# EAGLE design D1MSERVO (EAGLE 6.5.0)
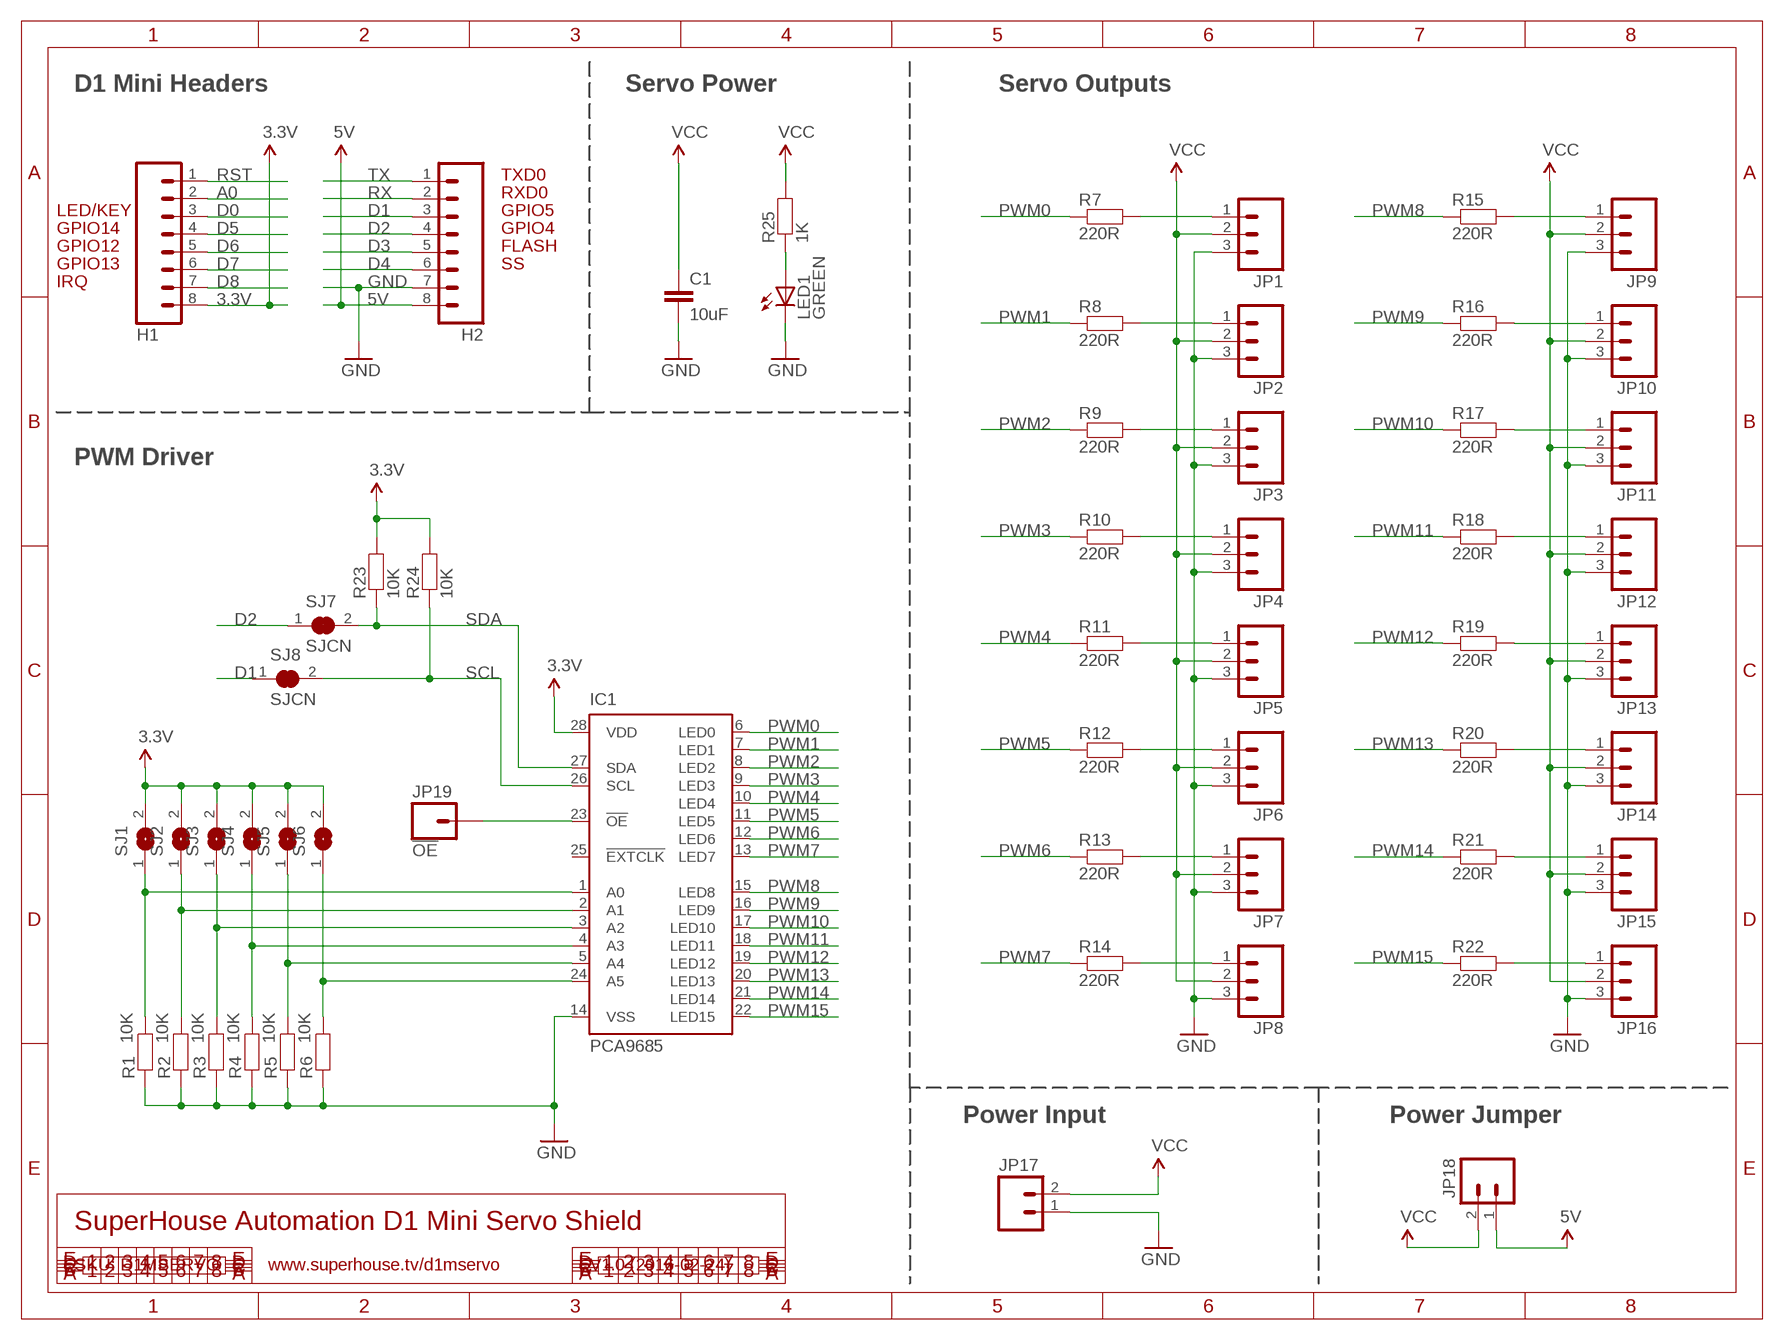
[diagram p0: schematic, sheet 1]

## Parts
C1  10uF  CAP0805  [0805]
H1  M08  [1X08]
H2  M08  [1X08]
IC1  PCA9685  [TSSOP28]
JP1  M03PTH  [1X03]
JP2  M03PTH  [1X03]
JP3  M03PTH  [1X03]
JP4  M03PTH  [1X03]
JP5  M03PTH  [1X03]
JP6  M03PTH  [1X03]
JP7  M03PTH  [1X03]
JP8  M03PTH  [1X03]
JP9  M03PTH  [1X03]
JP10  M03PTH  [1X03]
JP11  M03PTH  [1X03]
JP12  M03PTH  [1X03]
JP13  M03PTH  [1X03]
JP14  M03PTH  [1X03]
JP15  M03PTH  [1X03]
JP16  M03PTH  [1X03]
JP17  M023.5MM  [SCREWTERMINAL-3.5MM-2]
JP18  M02PTH  [1X02]
JP19  !OE  M01PTH  [1X01]
LED1  GREEN  LED0603  [LED-0603]
R1  10K  RESISTOR0603  [0603]
R2  10K  RESISTOR0603  [0603]
R3  10K  RESISTOR0603  [0603]
R4  10K  RESISTOR0603  [0603]
R5  10K  RESISTOR0603  [0603]
R6  10K  RESISTOR0603  [0603]
R7  220R  RESISTOR0603  [0603]
R8  220R  RESISTOR0603  [0603]
R9  220R  RESISTOR0603  [0603]
R10  220R  RESISTOR0603  [0603]
R11  220R  RESISTOR0603  [0603]
R12  220R  RESISTOR0603  [0603]
R13  220R  RESISTOR0603  [0603]
R14  220R  RESISTOR0603  [0603]
R15  220R  RESISTOR0603  [0603]
R16  220R  RESISTOR0603  [0603]
R17  220R  RESISTOR0603  [0603]
R18  220R  RESISTOR0603  [0603]
R19  220R  RESISTOR0603  [0603]
R20  220R  RESISTOR0603  [0603]
R21  220R  RESISTOR0603  [0603]
R22  220R  RESISTOR0603  [0603]
R23  10K  RESISTOR0603  [0603]
R24  10K  RESISTOR0603  [0603]
R25  1K  RESISTOR0603  [0603]
SJ1  SJN  [SJ]
SJ2  SJN  [SJ]
SJ3  SJN  [SJ]
SJ4  SJN  [SJ]
SJ5  SJN  [SJ]
SJ6  SJN  [SJ]
SJ7  SJCN  [SJC]
SJ8  SJCN  [SJC]

## Nets
3.3V: H1.8 IC1.28(VDD) R23.2 R24.2 SJ1.2 SJ2.2 SJ3.2 SJ4.2 SJ5.2 SJ6.2
5V: H2.8 JP18.1
A0: H1.2
D0: H1.3
D1: H2.3 SJ8.1
D2: H2.4 SJ7.1
D3: H2.5
D4: H2.6
D5: H1.4
D6: H1.5
D7: H1.6
D8: H1.7
GND: C1.2 H2.7 IC1.14(VSS) JP1.3 JP2.3 JP3.3 JP4.3 JP5.3 JP6.3 JP7.3 JP8.3 JP9.3 JP10.3 JP11.3 JP12.3 JP13.3 JP14.3 JP15.3 JP16.3 JP17.1 LED1.C R1.1 R2.1 R3.1 R4.1 R5.1 R6.1
N$1: JP1.1 R7.2
N$2: JP2.1 R8.2
N$3: IC1.1(A0) R1.2 SJ1.1
N$4: IC1.2(A1) R2.2 SJ2.1
N$5: IC1.3(A2) R3.2 SJ3.1
N$6: IC1.4(A3) R4.2 SJ4.1
N$7: IC1.5(A4) R5.2 SJ5.1
N$8: IC1.24(A5) R6.2 SJ6.1
N$9: JP3.1 R9.2
N$10: JP4.1 R10.2
N$11: JP5.1 R11.2
N$12: JP6.1 R12.2
N$13: JP7.1 R13.2
N$14: JP9.1 R15.2
N$15: JP8.1 R14.2
N$16: JP10.1 R16.2
N$17: JP11.1 R17.2
N$18: JP12.1 R18.2
N$19: JP13.1 R19.2
N$20: JP14.1 R20.2
N$21: JP15.1 R21.2
N$22: JP16.1 R22.2
N$23: LED1.A R25.1
N$24: IC1.23(!OE) JP19.1
PWM0: IC1.6(LED0) R7.1
PWM1: IC1.7(LED1) R8.1
PWM2: IC1.8(LED2) R9.1
PWM3: IC1.9(LED3) R10.1
PWM4: IC1.10(LED4) R11.1
PWM5: IC1.11(LED5) R12.1
PWM6: IC1.12(LED6) R13.1
PWM7: IC1.13(LED7) R14.1
PWM8: IC1.15(LED8) R15.1
PWM9: IC1.16(LED9) R16.1
PWM10: IC1.17(LED10) R17.1
PWM11: IC1.18(LED11) R18.1
PWM12: IC1.19(LED12) R19.1
PWM13: IC1.20(LED13) R20.1
PWM14: IC1.21(LED14) R21.1
PWM15: IC1.22(LED15) R22.1
RST: H1.1
RX: H2.2
SCL: IC1.26(SCL) R24.1 SJ8.2
SDA: IC1.27(SDA) R23.1 SJ7.2
TX: H2.1
VCC: C1.1 JP1.2 JP2.2 JP3.2 JP4.2 JP5.2 JP6.2 JP7.2 JP8.2 JP9.2 JP10.2 JP11.2 JP12.2 JP13.2 JP14.2 JP15.2 JP16.2 JP17.2 JP18.2 R25.2
Unconnected: IC1.25(!EXTCLK)

## Notes on the sheet
- D1 Mini Headers | Servo Power | Servo Outputs
- TXD0
- RXD0
- LED/KEY | GPIO5
- GPIO14 | GPIO4
- GPIO12 | FLASH
- GPIO13 | SS
- IRQ
- PWM Driver
- Power Input | Power Jumper
- SuperHouse Automation D1 Mini Servo Shield
- SKU: D1MSERVO | www.superhouse.tv/d1mservo | V1.0 (2016-02-24)

## Library data of the parts
C1 = freetronics-jon:CAP: Capacitor Standard 0603 ceramic capacitor, and 0.1" leaded capacitor.
H1 H2 = freetronics-original:M08: Header 8 Standard 8-pin 0.1" header. Use with straight break away headers (SKU : PRT-00116), right angle break away headers (PRT-00553), swiss pins (PRT-00743), machine pins (PRT-00117), and female headers (PRT-00115).
IC1 = freetronics-jon:PCA9685
JP1-JP16 = freetronics-jon:M03: Header 3 Standard 3-pin 0.1" header. Use with straight break away headers (SKU : PRT-00116), right angle break away headers (PRT-00553), swiss pins (PRT-00743), machine pins (PRT-00117), and female headers (PRT-00115). Molex polarized connector foot print use with SKU : PRT-08232 with associated crimp pins and housings.
JP17 JP18 = freetronics-jon:M02: Header 2 Standard 2-pin 0.1" header. Use with straight break away headers (SKU : PRT-00116), right angle break away headers (PRT-00553), swiss pins (PRT-00743), machine pins (PRT-00117), and female headers (PRT-00115). Molex polarized connector foot print use with SKU : PRT-08233 with associated crimp pins and housings.
JP19 = freetronics-original:M01: Header 1 Standard 1-pin 0.1" header. Use with straight break away headers (SKU : PRT-00116), right angle break away headers (PRT-00553), swiss pins (PRT-00743), machine pins (PRT-00117), and female headers (PRT-00115).
LED1 = freetronics-jon:LED: LEDs Standard schematic elements and footprints for 5mm, 3mm, 1206, and 0603 sized LEDs. 5mm - Spark Fun Electronics SKU : COM-00529 (and others)
R1-R25 = freetronics-jon:RESISTOR: Resistor Basic schematic elements and footprints for 0603, 1206, and PTH 1/10th watt (small) resistors.
SJ1-SJ6 = freetronics-jon:SJ: SMD solder JUMPER
SJ7 SJ8 = freetronics-jon:SJC

## Net classes
0 default: width 0.203 mm, drill 0.356 mm, clearance 0.152 mm
1 power: width 0.203 mm, clearance 0.152 mm

## Board
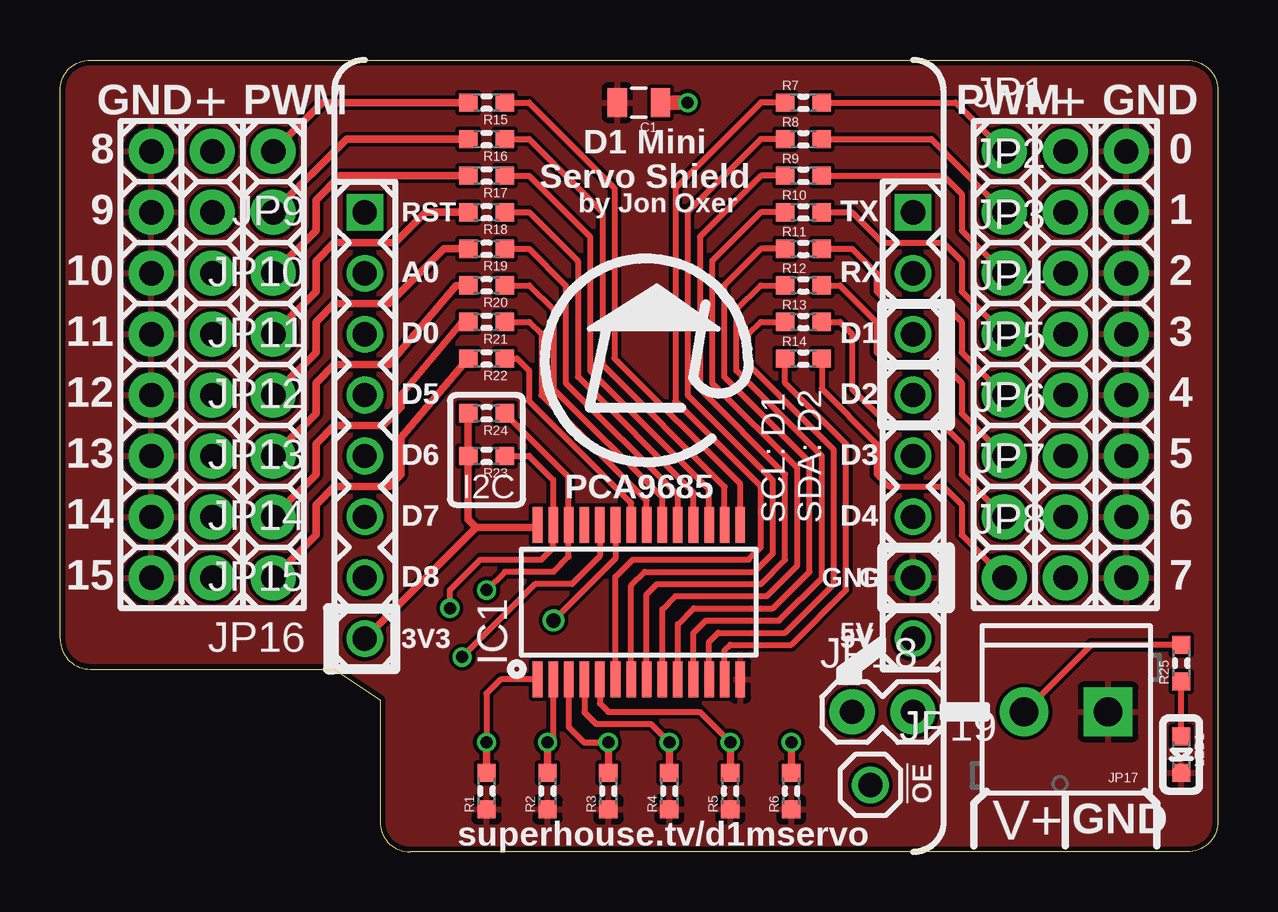
[diagram p1: board, top side]
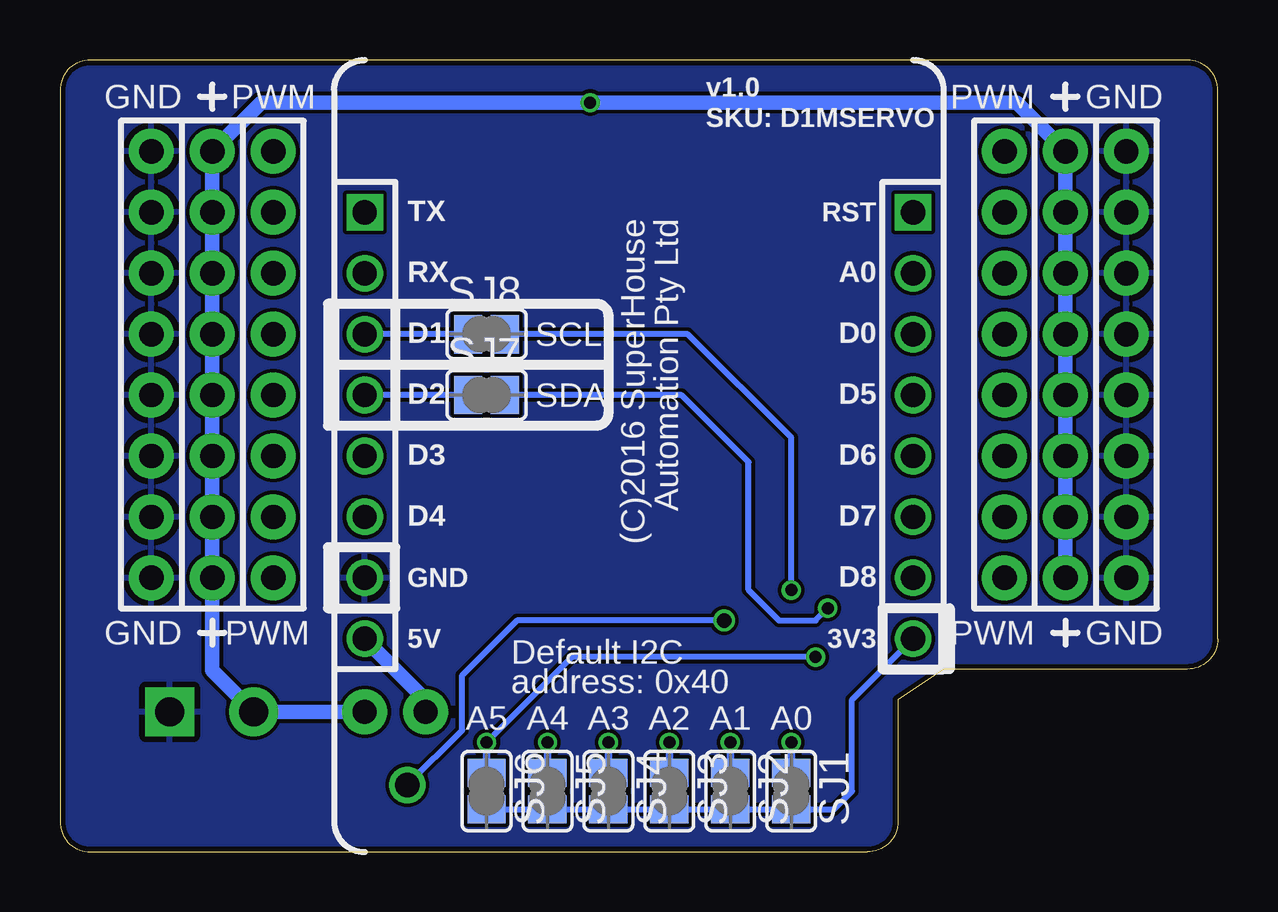
[diagram p2: board, bottom side, seen from below]

Size 48.26 x 33.02 mm. Coordinates in mm from the lower left corner, seen from the top.
Outline: 48.26,31.75 48.26,1.27 arc-90 46.99,0 14.61,0 arc-90 13.34,1.27 13.34,6.35 11.43,7.62 1.27,7.62 arc-90 0,8.89 0,31.75 arc-90 1.27,33.02 46.99,33.02 arc-90 48.26,31.75
Copper layers (1*16): Top 0.035mm / dielectric 1.5mm / Bottom 0.035mm
Design rules "ElectroDragon_2layer_DRU_no_angle_20140221": minimum track width 6mil, minimum drill 12mil, track to track 6mil, track to pad 6mil, pad to pad 6mil, via to via 6mil, smd to smd 6mil, copper to edge 8mil, drill to drill 6mil, minimum pad ring 10mil, minimum via ring 6mil, stop-mask expansion 4mil, vias tented up to drill 100mil, thermal gap 10mil

### Footprints (pad centres in the part's own frame; a part is rotated, then mirrored left to right if it is on the bottom)
0805 = smd 0.8 x 1.2: 1 -0.9,0; 2 0.9,0
1X08 = drill 1.016 square: 1 0,0 | drill 1.016: 2 2.54,0; 3 5.08,0; 4 7.62,0; 5 10.16,0; 6 12.7,0; 7 15.24,0; 8 17.78,0
TSSOP28 = smd 0.4 x 1.5: 1 -4.225,-3.225; 2 -3.575,-3.225; 3 -2.925,-3.225; 4 -2.275,-3.225; 5 -1.625,-3.225; 6 -0.975,-3.225; 7 -0.325,-3.225; 8 0.325,-3.225; 9 0.975,-3.225; 10 1.625,-3.225; 11 2.275,-3.225; 12 2.925,-3.225; 13 3.575,-3.225; 14 4.225,-3.225; 15 4.225,3.225; 16 3.575,3.225; 17 2.925,3.225; 18 2.275,3.225; 19 1.625,3.225; 20 0.975,3.225; 21 0.325,3.225; 22 -0.325,3.225; 23 -0.975,3.225; 24 -1.625,3.225; 25 -2.275,3.225; 26 -2.925,3.225; 27 -3.575,3.225; 28 -4.225,3.225
1X03 = drill 1.016 pad 1.88: 1 0,0; 2 2.54,0; 3 5.08,0
SCREWTERMINAL-3.5MM-2 = drill 1.2 pad 2.032 square: 1 0,0 | drill 1.2 pad 2.032: 2 3.5,0
1X02 = drill 1.016 pad 1.88: 1 0,0; 2 2.54,0
1X01 = drill 1.016: 1 0,0
LED-0603 = smd 0.762 x 0.762: A -0.762,0; C 0.762,0
0603 = smd 0.762 x 0.762: 1 -0.762,0; 2 0.762,0
SJ = smd 1.168 x 1.6: 1 -0.762,0; 2 0.762,0
SJC = smd 1.168 x 1.6: 1 -0.762,0; 2 0.762,0

### Placement (x,y rotation side)
C1  24.13,31.24 180 top
H1  12.7,26.67 270 top
H2  35.56,26.67 270 top
IC1  24.13,10.41 0 top
JP1  39.37,29.21 0 top
JP2  39.37,26.67 0 top
JP3  39.37,24.13 0 top
JP4  39.37,21.59 0 top
JP5  39.37,19.05 0 top
JP6  39.37,16.51 0 top
JP7  39.37,13.97 0 top
JP8  39.37,11.43 0 top
JP9  8.89,29.21 180 top
JP10  8.89,26.67 180 top
JP11  8.89,24.13 180 top
JP12  8.89,21.59 180 top
JP13  8.89,19.05 180 top
JP14  8.89,16.51 180 top
JP15  8.89,13.97 180 top
JP16  8.89,11.43 180 top
JP17  43.69,5.84 180 top
JP18  33.02,5.84 0 top
JP19  33.78,2.79 0 top
LED1  46.74,4.06 270 top
R1  17.78,2.54 90 top
R2  20.32,2.54 90 top
R3  22.86,2.54 90 top
R4  25.4,2.54 90 top
R5  27.94,2.54 90 top
R6  30.48,2.54 90 top
R7  30.99,31.24 0 top
R8  30.99,29.72 0 top
R9  30.99,28.19 0 top
R10  30.99,26.67 0 top
R11  30.99,25.15 0 top
R12  30.99,23.62 0 top
R13  30.99,22.1 0 top
R14  30.99,20.57 0 top
R15  17.78,31.24 180 top
R16  17.78,29.72 180 top
R17  17.78,28.19 180 top
R18  17.78,26.67 180 top
R19  17.78,25.15 180 top
R20  17.78,23.62 180 top
R21  17.78,22.1 180 top
R22  17.78,20.57 180 top
R23  17.78,16.51 180 top
R24  17.78,18.29 180 top
R25  46.74,7.87 90 top
SJ1  17.78,2.54 270 bottom
SJ2  20.32,2.54 270 bottom
SJ3  22.86,2.54 270 bottom
SJ4  25.4,2.54 270 bottom
SJ5  27.94,2.54 270 bottom
SJ6  30.48,2.54 270 bottom
SJ7  30.48,19.05 0 bottom
SJ8  30.48,21.59 0 bottom

### Tracks (layer width: path | path; a pad name or v marks a point on that pad's centre or on a via)
3.3V
  Top 0.305: R24.2 R23.2 17.02,13.87 17.35,13.54 | H1.8 17.35,13.54 | 17.35,13.54 19.8,13.54 IC1.28
  Bottom 0.254: SJ6.2 SJ5.2 SJ4.2 SJ3.2 SJ2.2 SJ1.2 16,1.78 15.24,2.54 15.24,6.35 H1.8
5V
  Bottom 0.61: JP18.1 33.02,6.35 H2.8
D1
  Bottom 0.254: SJ8.1 H2.3
D2
  Bottom 0.254: SJ7.1 H2.4
GND
  pour Top: 48.26,31.75 arc90 46.99,33.02 1.27,33.02 arc90 0,31.75 0,8.89 arc90 1.27,7.62 11.43,7.62 13.34,6.35 13.34,1.27 arc90 14.61,0 46.99,0 arc90 48.26,1.27
  pour Bottom: 48.26,1.27 48.26,31.75 arc90 46.99,33.02 1.27,33.02 arc90 0,31.75 0,8.89 arc90 1.27,7.62 11.43,7.62 13.34,6.35 13.34,1.27 arc90 14.61,0 46.99,0 arc90
N$1
  Top 0.254: R7.2 37.34,31.24 JP1.1
N$2
  Top 0.254: R8.2 36.32,29.72 JP2.1
N$3  (via drill 0.5)
  Top 0.254: IC1.1 18.36,7.19 17.78,6.6 v17.78,4.57
  Top 0.305: v17.78,4.57 SJ1.1
  Bottom 0.305: SJ1.1 v17.78,4.57
N$4  (via drill 0.5)
  Top 0.254: IC1.2 20.55,4.81 v20.32,4.57
  Top 0.305: R2.2 v20.32,4.57
  Bottom 0.305: v20.32,4.57 R2.2
N$5  (via drill 0.5)
  Top 0.254: IC1.3 21.2,5.21 21.84,4.57 v22.86,4.57
  Top 0.305: v22.86,4.57 R3.2
  Bottom 0.305: R3.2 v22.86,4.57
N$6  (via drill 0.5)
  Top 0.254: IC1.4 21.86,5.83 22.35,5.33 24.64,5.33 v25.4,4.57
  Top 0.305: SJ4.1 v25.4,4.57
  Bottom 0.305: v25.4,4.57 SJ4.1
N$7  (via drill 0.5)
  Top 0.254: IC1.5 22.5,6.2 22.86,5.84 26.67,5.84 v27.94,4.57
  Top 0.305: v27.94,4.57 R5.2
  Bottom 0.305: R5.2 v27.94,4.57
N$8  (via drill 0.5)
  Top 0.254: IC1.24 22.5,12.35 21.34,11.18 19.81,11.18 v16.76,8.13
  Top 0.305: SJ6.1 v30.48,4.57
  Bottom 0.254: v16.76,8.13 26.92,8.13 v30.48,4.57
  Bottom 0.305: v30.48,4.57 SJ6.1
N$9
  Top 0.254: R9.2 36.83,28.19 37.59,27.43 37.59,25.91 JP3.1
N$10
  Top 0.254: R10.2 33.02,26.67 34.29,25.4 36.83,25.4 37.59,24.64 37.59,23.37 JP4.1
N$11
  Top 0.254: R11.2 33.02,25.15 34.04,24.13 34.04,23.37 34.54,22.86 36.83,22.86 37.59,22.1 37.59,20.83 JP5.1
N$12
  Top 0.254: R12.2 32.51,23.62 34.04,22.1 34.04,20.83 34.54,20.32 36.83,20.32 37.59,19.56 37.59,18.29 JP6.1
N$13
  Top 0.254: R13.2 32.51,22.1 33.02,21.59 33.02,19.3 34.54,17.78 36.83,17.78 37.59,17.02 37.59,15.75 JP7.1
N$14
  Top 0.305: R15.2 10.92,31.24 JP9.1
N$15
  Top 0.254: R14.2 31.75,19.3 34.04,17.02 34.04,15.75 34.54,15.24 36.83,15.24 37.59,14.48 37.59,13.21 JP8.1
N$16
  Top 0.305: R16.2 11.94,29.72 JP10.1
N$17
  Top 0.305: R17.2 11.68,28.19 10.67,27.18 10.67,25.91 JP11.1
N$18
  Top 0.305: R18.2 15.24,26.67 13.97,25.4 11.43,25.4 10.67,24.64 10.67,23.37 JP12.1
N$19
  Top 0.305: R19.2 16,25.15 13.72,22.86 11.43,22.86 10.67,22.1 10.67,20.83 JP13.1
N$20
  Top 0.305: R20.2 16.51,23.62 13.72,20.32 11.43,20.32 10.67,19.56 10.67,18.29 JP14.1
N$21
  Top 0.305: R21.2 16.76,22.1 14.22,19.05 14.22,18.54 13.46,17.78 11.43,17.78 10.67,17.02 10.67,15.75 JP15.1
N$22
  Top 0.305: R22.2 14.22,17.27 14.22,15.75 13.72,15.24 11.43,15.24 10.67,14.48 10.67,13.21 JP16.1
N$23
  Top 0.254: LED1.A R25.1
N$24  (via drill 0.6)
  Top 0.254: IC1.23 23.16,12.23 v20.57,9.65
  Bottom 0.254: v20.57,9.65 29.21,9.65 31.5,7.37 31.5,5.08 JP19.1
PWM0
  Top 0.254: IC1.6 23.16,11.47 23.88,12.19 28.7,12.19 29.21,12.7 29.21,15.24 25.65,18.8 25.65,27.69 29.21,31.24 R7.1
PWM1
  Top 0.254: IC1.7 23.8,11.11 24.38,11.68 28.96,11.68 29.72,12.45 29.72,15.49 26.16,19.05 26.16,26.67 29.21,29.72 R8.1
PWM2
  Top 0.254: IC1.8 24.45,10.74 24.89,11.18 29.21,11.18 30.23,12.19 30.23,15.75 26.67,19.3 26.67,25.65 29.21,28.19 R9.1
PWM3
  Top 0.254: IC1.9 25.11,10.12 25.65,10.67 29.46,10.67 30.73,11.94 30.73,16 27.18,19.56 27.18,24.64 29.21,26.67 R10.1
PWM4
  Top 0.254: IC1.10 25.75,9.5 26.42,10.16 29.72,10.16 31.24,11.68 31.24,16.26 27.69,19.81 27.69,23.62 29.21,25.15 R11.1
PWM5
  Top 0.254: IC1.11 26.41,9.13 26.92,9.65 29.97,9.65 31.75,11.43 31.75,16.51 28.19,20.07 28.19,22.61 29.21,23.62 R12.1
PWM6
  Top 0.254: IC1.12 27.05,8.77 27.43,9.14 30.23,9.14 32.26,11.18 32.26,16.76 28.7,20.32 28.7,21.59 29.21,22.1 R13.1
PWM7
  Top 0.254: IC1.13 27.7,8.4 27.94,8.64 30.48,8.64 32.77,10.92 32.77,17.02 30.23,19.56 R14.1
PWM8
  Top 0.254: IC1.15 28.36,15.33 23.11,20.57 23.11,27.69 19.56,31.24 R15.1
PWM9
  Top 0.254: IC1.16 27.7,15.22 22.61,20.32 22.61,26.67 19.56,29.72 R16.1
PWM10
  Top 0.254: IC1.17 27.05,15.11 22.1,20.07 22.1,25.65 19.56,28.19 R17.1
PWM11
  Top 0.254: IC1.18 26.41,15 21.59,19.81 21.59,24.64 19.56,26.67 R18.1
PWM12
  Top 0.254: IC1.19 25.75,14.88 21.08,19.56 21.08,23.62 19.56,25.15 R19.1
PWM13
  Top 0.254: IC1.20 25.11,14.77 20.57,19.3 20.57,22.61 19.56,23.62 R20.1
PWM14
  Top 0.254: IC1.21 24.45,14.66 20.07,19.05 20.07,21.59 19.56,22.1 R21.1
PWM15
  Top 0.254: IC1.22 23.8,14.55 19.56,18.8 19.56,20.07 19.05,20.57 R22.1
SCL  (via drill 0.5)
  Top 0.254: R24.1 21.2,15.62 IC1.26 21.2,12.31 20.57,11.68 18.54,11.68 v17.78,10.92
  Bottom 0.254: v17.78,10.92 17.78,17.27 22.1,21.59 SJ8.2
SDA  (via drill 0.5)
  Top 0.254: v16.26,10.16 16.26,10.92 17.53,12.19 20.07,12.19 20.55,12.68 | 20.55,12.68 20.57,12.7 | R23.1 19.56,16.51 20.55,15.51 IC1.27 20.55,12.68
  Bottom 0.254: v16.26,10.16 16.76,9.65 18.29,9.65 19.56,10.92 19.56,16.26 22.35,19.05 SJ7.2
VCC  (via drill 0.5)
  Top 0.254: R25.2 42.98,8.64 JP17.2
  Top 0.61: C1.1 v26.16,31.24
  Bottom 0.61: JP16.2 JP15.2 JP14.2 JP13.2 JP12.2 JP11.2 JP10.2 JP9.2 8.38,31.24 v26.16,31.24 39.88,31.24 JP1.2 JP2.2 JP3.2 JP4.2 JP5.2 JP6.2 JP7.2 JP8.2 41.91,7.56 JP17.2 JP18.2

### Text on the board
tPlace: GND | PWM | PWM | GND | + | + | 8 | 0 | D1 Mini / Servo Shield | by Jon Oxer | 9 | RST | TX | 1 | 10 | A0 | RX | 2 | 11 | D0 | D1 | 3 | 12 | D5 | D2 | 4 | 13 | D6 | D3 | 5 | I2C | PCA9685 | D7 | SCL: D1 / SDA: D2 | D4 | 14 | 6 | 15 | D8 | GND | 7 | 3V3 | 5V | !OE | V+ | GND | superhouse.tv/d1mservo
bPlace: GND | PWM | v1.0 | PWM | GND | SKU: D1MSERVO | RST | (C)2016 SuperHouse / Automation Pty Ltd | TX | A0 | RX | D0 | SCL | D1 | D5 | SDA | D2 | D6 | D3 | D7 | D4 | D8 | GND | GND | PWM | 3V3 | 5V | PWM | GND | Default I2C / address: 0x40 | A0 | A1 | A2 | A3 | A4 | A5
tNames: RST | TX | A0 | RX | D0 | D1 | D5 | D2 | D6 | D3 | D7 | D4 | D8 | G | 3V3 | 5V